# EAGLE schematic Teensy3 based M&M board 5x5 (EAGLE 6.4)
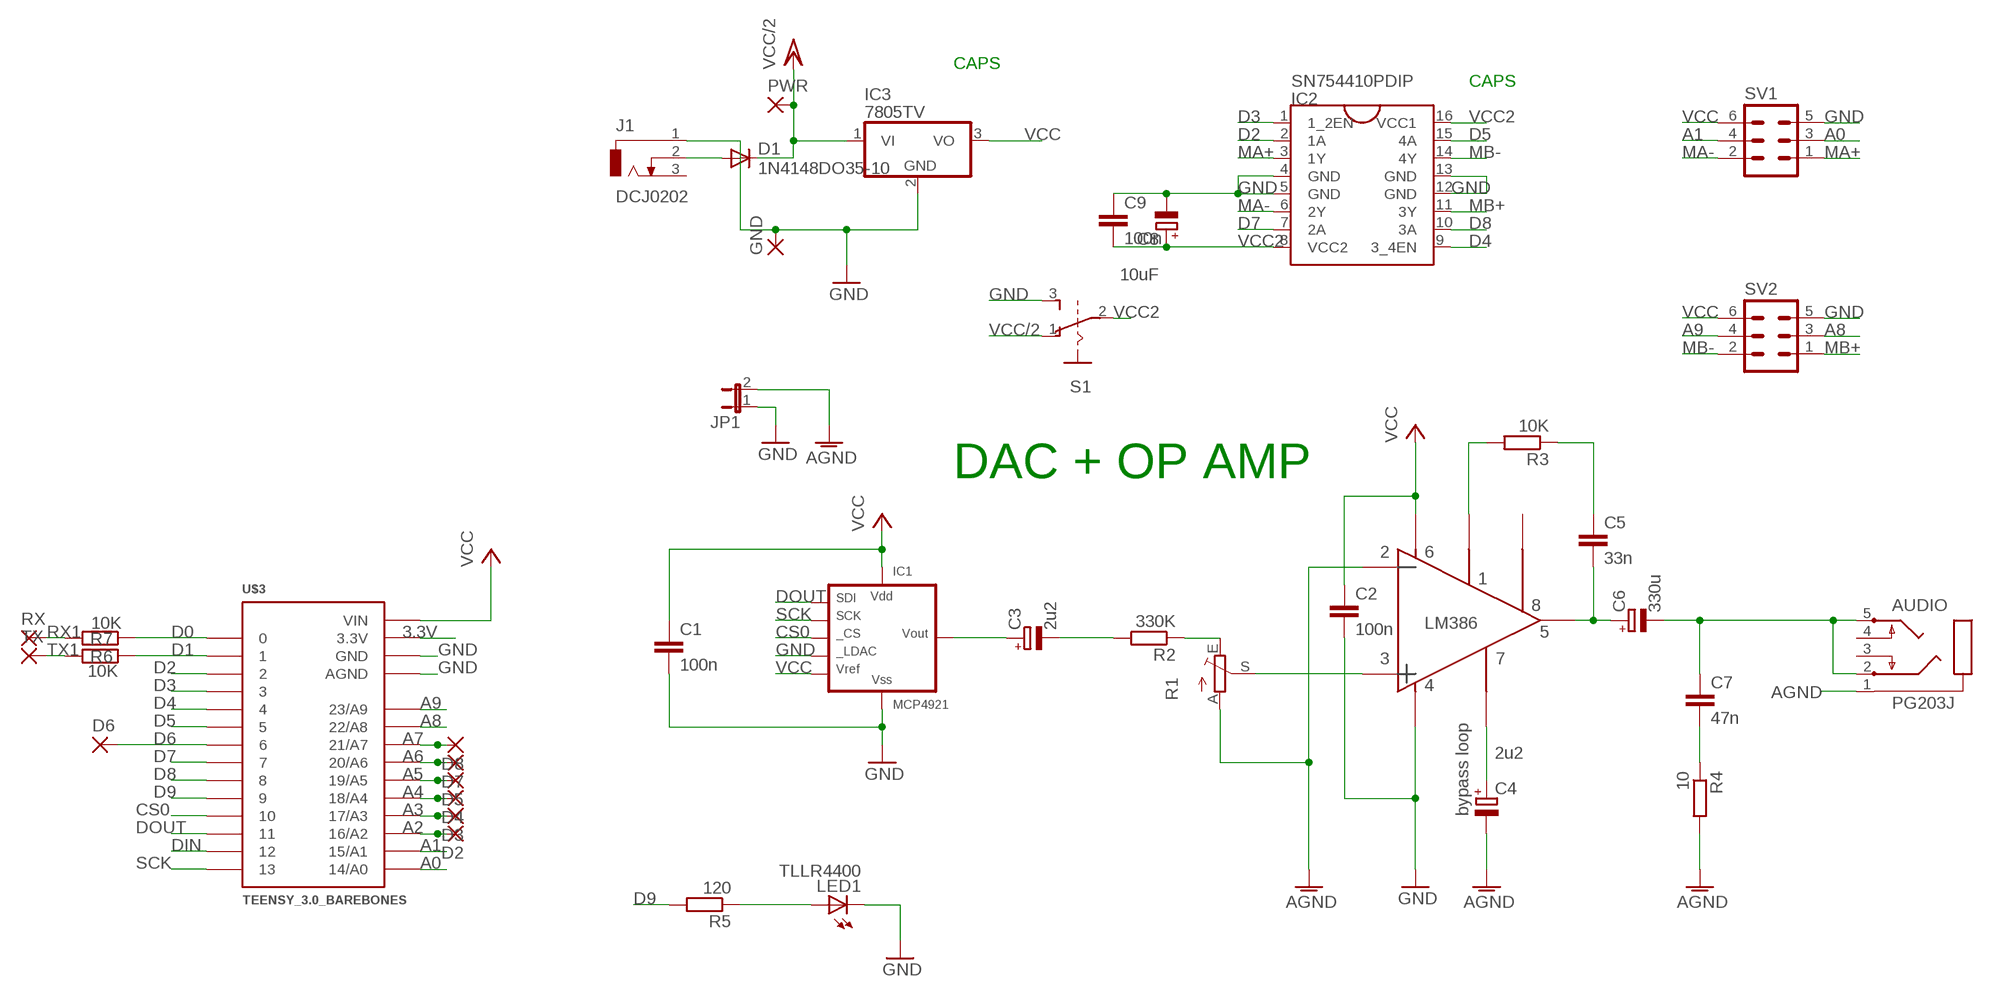
[diagram p0: schematic, sheet 1]

## Parts
AUDIO  PG203J  [PG203J]
C1  100n  C-EU050-030X075  [C050-030X075]
C2  100n  C-EU050-030X075  [C050-030X075]
C3  2u2  CPOL-EUE2-5  [E2-5]
C4  2u2  CPOL-EUE2-5  [E2-5]
C5  33n  C-EU050-030X075  [C050-030X075]
C6  330u  CPOL-EUE2.5-7  [E2,5-7]
C7  47n  C-EU050-030X075  [C050-030X075]
C8  10uF  CPOL-EUE2-5  [E2-5]
C9  100n  C-EU050-030X075  [C050-030X075]
D1  1N4148DO35-10  [DO35-10]
D2  2,15/1,0  [2,15/1,0]
D3  2,15/1,0  [2,15/1,0]
D4  2,15/1,0  [2,15/1,0]
D5  2,15/1,0  [2,15/1,0]
D6  2,15/1,0  [2,15/1,0]
D7  2,15/1,0  [2,15/1,0]
D8  2,15/1,0  [2,15/1,0]
GND  2,15/1,0  [2,15/1,0]
IC1  MCP4921  MCP4921P  [DIL8]
IC2  SN754410PDIP  [DIL16]
IC3  7805TV  [TO220V]
J1  DCJ0202  [DCJ0202]
JP1  JP1E  [JP1]
LED1  TLLR4400  [LED3MM]
PWR  2,15/1,0  [2,15/1,0]
R1  TRIM_EU-CA9V  [CA9V]
R2  330K  R-EU_0207/10  [0207/10]
R3  10K  R-EU_0207/10  [0207/10]
R4  10  R-EU_0207/10  [0207/10]
R5  120  R-EU_0207/10  [0207/10]
R6  10K  R-EU_0207/10  [0207/10]
R7  10K  R-EU_0207/10  [0207/10]
RX  2,15/1,0  [2,15/1,0]
S1  EG1218  [GF-126-0159]
SV1  ML6  [ML6]
SV2  ML6  [ML6]
TX  2,15/1,0  [2,15/1,0]
U$2  LM386  LM386OA  [LM386]
U$3  TEENSY_3.0_BAREBONES  [TEENSY_3.0_BAREBONES]

## Nets
3.3V [power]: U$3.3.3V
A0: SV1.3 U$3.14/A0
A1: SV1.4 U$3.15/A1
A2: D2.1(P) U$3.16/A2
A3: D3.1(P) U$3.17/A3
A4: D4.1(P) U$3.18/A4
A5: D5.1(P) U$3.19/A5
A6: D7.1(P) U$3.20/A6
A7: D8.1(P) U$3.21/A7
A8: SV2.3 U$3.22/A8
A9: SV2.4 U$3.23/A9
AGND [power]: AUDIO.1 C4.- JP1.2 R1.A R4.2 U$2.2
AMP_IN: R1.S U$2.3
CS0: IC1.2(CS) U$3.10
D0: R7.1 U$3.0
D1: R6.1 U$3.1
D2: IC2.2(1A) U$3.2
D3: IC2.1(1_2EN) U$3.3
D4: IC2.9(3_4EN) U$3.4
D5: IC2.15(4A) U$3.5
D6: D6.1(P) U$3.6
D7: IC2.7(2A) U$3.7
D8: IC2.10(3A) U$3.8
D9: R5.2 U$3.9
DAC_OUT: C3.+ IC1.8(VOUT)
DIN: U$3.12
DOUT: IC1.4(SDI) U$3.11
GND [power]: C1.2 C2.2 C8.- C9.1 GND.1(P) IC1.5(LDAC) IC1.7(VSS) IC2.4(GND) IC2.5(GND) IC2.12(GND) IC2.13(GND) IC3.2(GND) J1.1 JP1.1 LED1.K(C) S1.3 SV1.5 SV2.5 U$2.4 U$3.AGND U$3.GND
MA+: IC2.3(1Y) SV1.1
MA-: IC2.6(2Y) SV1.2
MB+: IC2.11(3Y) SV2.1
MB-: IC2.14(4Y) SV2.2
N$1: D1.A J1.2
N$2: R3.2 U$2.1
N$3: C3.- R2.2
N$4: R1.E R2.1
N$5: LED1.A R5.1
N$9: C5.1 R3.1
N$10: C4.+ U$2.7
N$78: C7.2 R4.1
N$84: AUDIO.2 AUDIO.5 C6.- C7.1
N$99: C5.2 C6.+ U$2.5
RX1: R7.2 RX.1(P)
SCK: IC1.3(SCK) U$3.13
TX1: R6.2 TX.1(P)
VCC [power]: C1.1 C2.1 IC1.1(VDD) IC1.6(VREF) IC3.3(VO) SV1.6 SV2.6 U$2.6 U$3.VIN
VCC2: C8.+ C9.2 IC2.8(VCC2) IC2.16(VCC1) S1.2
VCC/2: D1.C IC3.1(VI) PWR.1(P) S1.1
Unconnected: AUDIO.3 AUDIO.4 J1.3 U$2.8

## Notes on the sheet
- CAPS
- CAPS
- DAC + OP AMP
- bypass loop

## Library data of the parts
AUDIO = con-hirschmann:PG203J: MIC/HEADPHONE JACK KS-S stereo microphone/headphone jack PG203JN (Schukat)
C1 C2 C5 C7 C9 = rcl:C-EU: CAPACITOR, European symbol
C3 C4 C6 C8 = rcl:CPOL-EU: POLARIZED CAPACITOR, European symbol
D1 = diode:1N4148: DIODE high speed (Philips)
D2-D8 GND PWR RX TX = wirepad:2,15/1,0: THROUGH-HOLE PAD
IC1 = microchip-dac:MCP4921: MCP4921: 12-bit DAC MCP4901/4911/4921 - 8/10/12-Bit Voltage Output Digital-to-Analog Converter with SPI Interface Interface The MCP49x1 devices are single channel 8-bit, 10-bit and 12-bit buffered voltage output Digital-to-Analog Converters (DACs), respectively. The devices operate from a single 2.7V to 5.5V supply with an SPI compatible Serial Peripheral Interface. The user can configure the full-scale range of the device to be VREF or 2*VREF by setting the Gain Selection Option bit (gain of 1 of 2). RobG
IC2 = AlexW-Eagle-Libraries:SN754410
IC3 = linear:78*: Positive VOLTAGE REGULATOR Source: http://cache.national.com/ds/LM/LM78L05.pdf http://www.fairchildsemi.com/ds/LM/LM7805.pdf
J1 = con-jack:DCJ0202: DC POWER JACK Source: DCJ0202.pdf; OC_FARNELL: unknown; OC_NEWARK: unknown
JP1 = jumper:JP1E: JUMPER
LED1 = led:TLLR4400: Low Current (2mA) LED 3 mm Tinted Diffused Package color RED Source: Data sheet <http://www.farnell.com/datasheets/391100.pdf>; MF: VISHAY SEMICONDUCTOR; OC_FARNELL: 1612437
R1 = pot:TRIM_EU-: POTENTIOMETER
R2-R7 = rcl:R-EU_: RESISTOR, European symbol
S1 = videomusik:EG1218
SV1 SV2 = con-harting-ml:ML6: HARTING; OC_FARNELL: unknown; OC_NEWARK: unknown
U$2 = blushingboy_experimental:LM386
U$3 = Teensy3.0:TEENSY_3.0_BAREBONES

## Net classes
1 power: width 0.61 mm